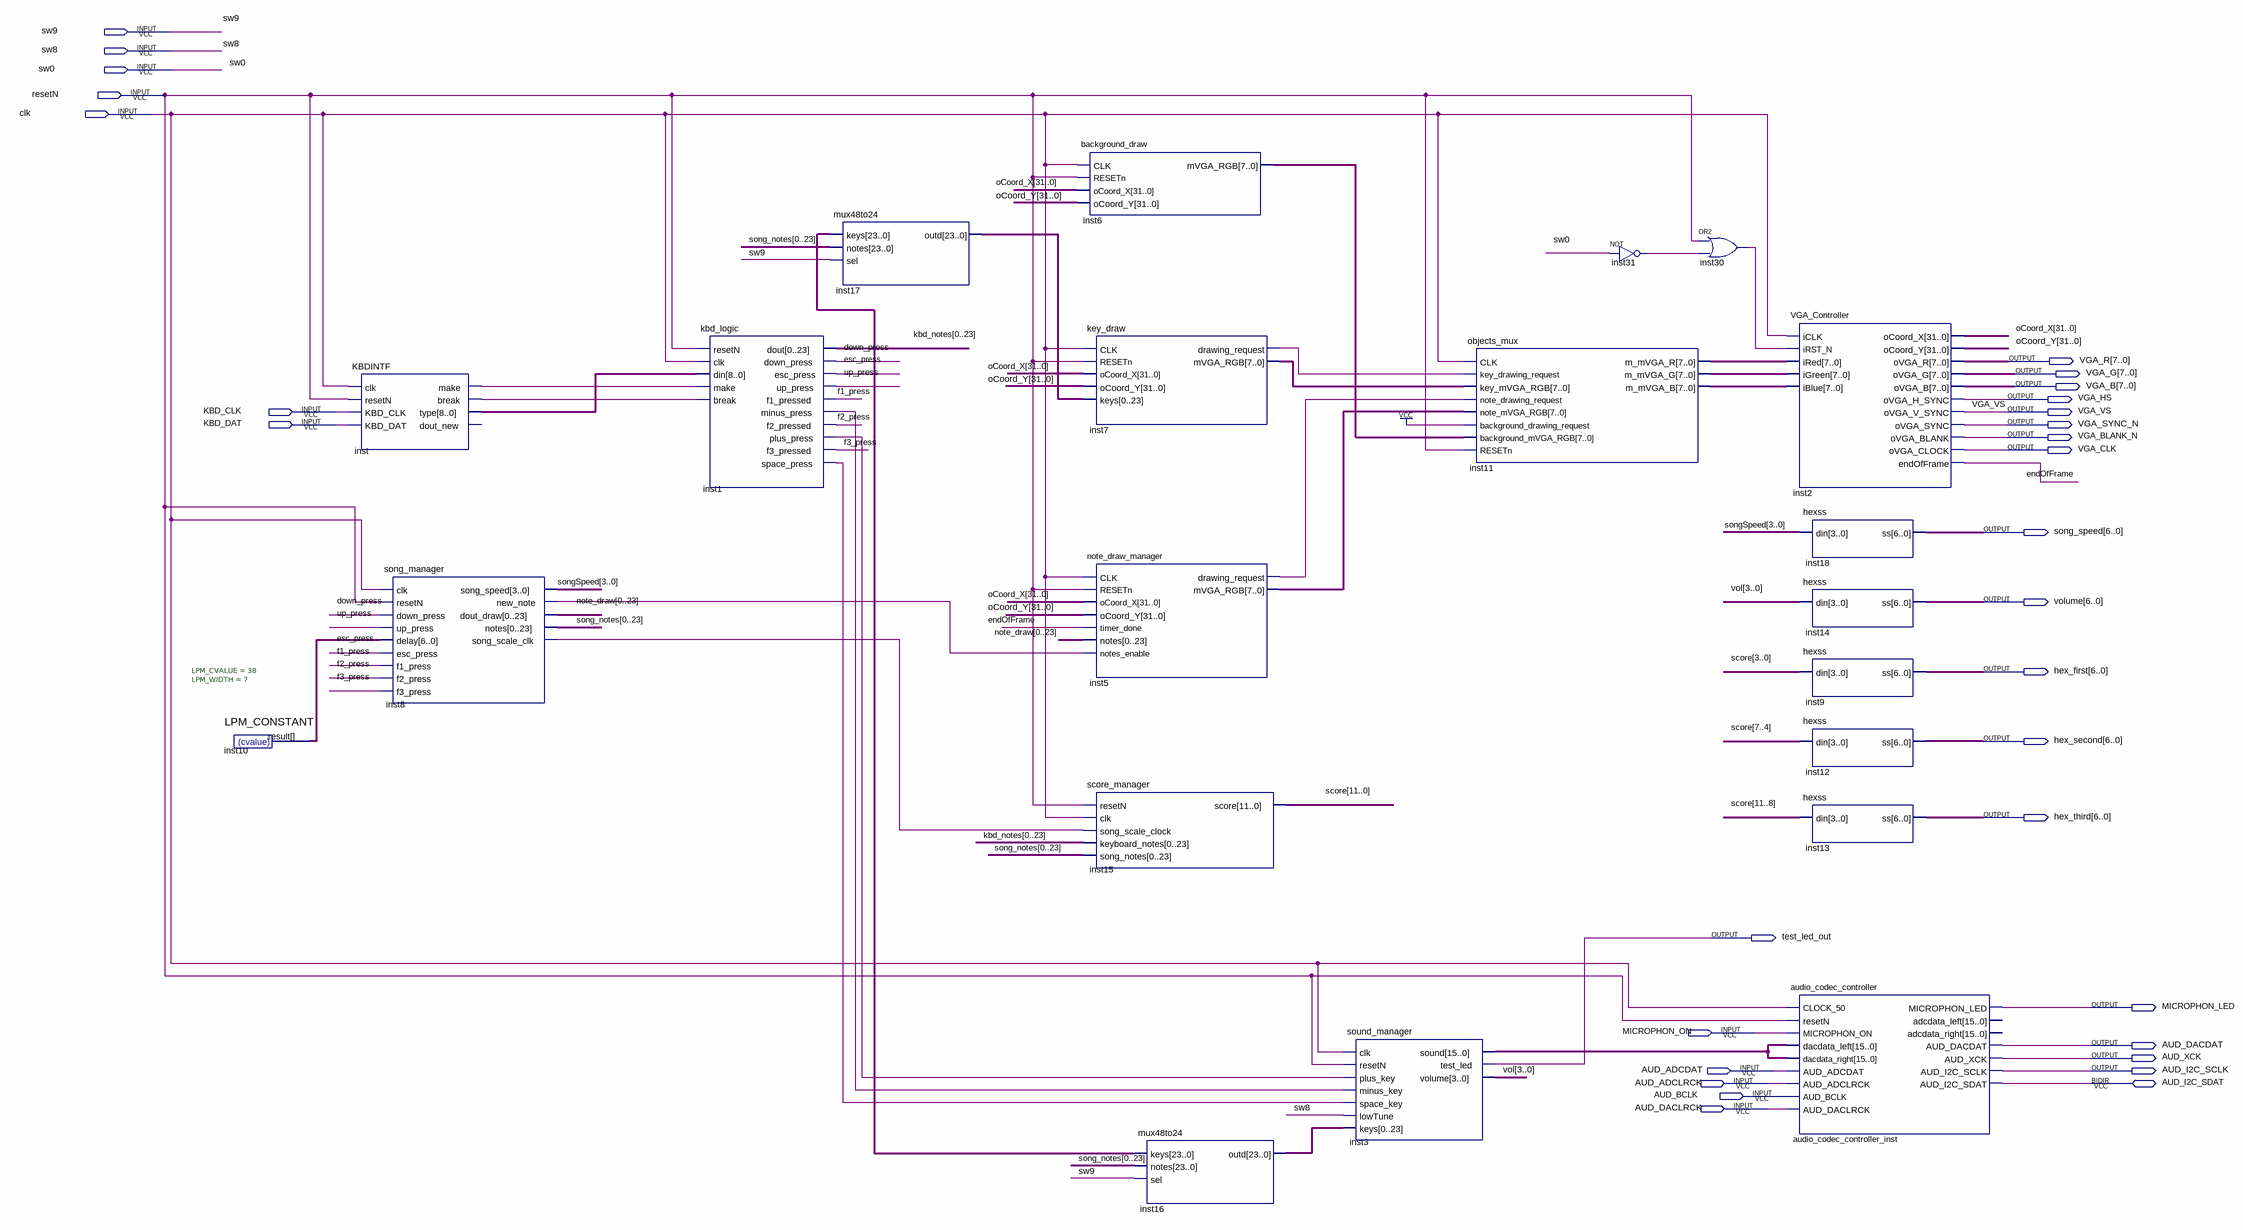
[diagram p0: schematic sheet]
// Quartus schematic top.bdf as structural Verilog: 21 symbols, 31 pins
module top (
  input  sw9,
  input  sw8,
  input  sw0,
  input  resetN,
  input  clk,
  input  KBD_CLK,
  input  KBD_DAT,
  input  MICROPHON_ON,
  input  AUD_ADCDAT,
  input  AUD_ADCLRCK,
  input  AUD_BCLK,
  input  AUD_DACLRCK,
  inout  AUD_I2C_SDAT,
  output [7:0] VGA_R,
  output [7:0] VGA_G,
  output [7:0] VGA_B,
  output VGA_HS,
  output VGA_VS,
  output VGA_SYNC_N,
  output VGA_BLANK_N,
  output VGA_CLK,
  output [6:0] song_speed,
  output [6:0] volume,
  output [6:0] hex_first,
  output [6:0] hex_second,
  output [6:0] hex_third,
  output test_led_out,
  output MICROPHON_LED,
  output AUD_DACDAT,
  output AUD_XCK,
  output AUD_I2C_SCLK
);

  wire down_press, endOfFrame, esc_press, f1_press, f2_press, f3_press, inst1_minus_press, inst1_plus_press,
       inst1_space_press, inst5_drawing_request, inst7_drawing_request, inst8_new_note, inst8_song_scale_clk,
       inst30_out, inst31_out, inst_break, inst_make, up_press;
  wire [3:0] songSpeed, vol;
  wire [6:0] inst10_result;
  wire [7:0] inst5_mvga_rgb, inst6_mvga_rgb, inst7_mvga_rgb, inst11_m_mvga_b, inst11_m_mvga_g,
       inst11_m_mvga_r;
  wire [8:0] inst_type;
  wire [11:0] score;
  wire [15:0] inst3_sound;
  wire [23:0] inst16_outd, inst17_outd, kbd_notes, note_draw, song_notes;
  wire [31:0] oCoord_X, oCoord_Y;

  LPM_CONSTANT #(.LPM_CVALUE(38), .LPM_WIDTH(7)) inst10 (.result(inst10_result));
  KBDINTF inst (
    .clk(clk), .resetN(resetN), .KBD_CLK(KBD_CLK), .KBD_DAT(KBD_DAT), .make(inst_make), .\break (inst_break),
    .\type (inst_type));  // open: dout_new
  song_manager inst8 (
    .clk(clk), .resetN(resetN), .down_press(down_press), .up_press(up_press), .delay(inst10_result),
    .esc_press(esc_press), .f1_press(f1_press), .f2_press(f2_press), .f3_press(f3_press),
    .song_speed(songSpeed), .new_note(inst8_new_note),
    .dout_draw({note_draw[0], note_draw[1], note_draw[2], note_draw[3], note_draw[4], note_draw[5], note_draw[6], note_draw[7], note_draw[8], note_draw[9], note_draw[10], note_draw[11], note_draw[12], note_draw[13], note_draw[14], note_draw[15], note_draw[16], note_draw[17], note_draw[18], note_draw[19], note_draw[20], note_draw[21], note_draw[22], note_draw[23]}),
    .notes({song_notes[0], song_notes[1], song_notes[2], song_notes[3], song_notes[4], song_notes[5], song_notes[6], song_notes[7], song_notes[8], song_notes[9], song_notes[10], song_notes[11], song_notes[12], song_notes[13], song_notes[14], song_notes[15], song_notes[16], song_notes[17], song_notes[18], song_notes[19], song_notes[20], song_notes[21], song_notes[22], song_notes[23]}),
    .song_scale_clk(inst8_song_scale_clk));
  kbd_logic inst1 (
    .resetN(resetN), .clk(clk), .din(inst_type), .make(inst_make), .\break (inst_break),
    .dout({kbd_notes[0], kbd_notes[1], kbd_notes[2], kbd_notes[3], kbd_notes[4], kbd_notes[5], kbd_notes[6], kbd_notes[7], kbd_notes[8], kbd_notes[9], kbd_notes[10], kbd_notes[11], kbd_notes[12], kbd_notes[13], kbd_notes[14], kbd_notes[15], kbd_notes[16], kbd_notes[17], kbd_notes[18], kbd_notes[19], kbd_notes[20], kbd_notes[21], kbd_notes[22], kbd_notes[23]}),
    .down_press(down_press), .esc_press(esc_press), .up_press(up_press), .f1_pressed(f1_press),
    .minus_press(inst1_minus_press), .f2_pressed(f2_press), .plus_press(inst1_plus_press),
    .f3_pressed(f3_press), .space_press(inst1_space_press));
  mux48to24 inst17 (
    .keys({kbd_notes[0], kbd_notes[1], kbd_notes[2], kbd_notes[3], kbd_notes[4], kbd_notes[5], kbd_notes[6], kbd_notes[7], kbd_notes[8], kbd_notes[9], kbd_notes[10], kbd_notes[11], kbd_notes[12], kbd_notes[13], kbd_notes[14], kbd_notes[15], kbd_notes[16], kbd_notes[17], kbd_notes[18], kbd_notes[19], kbd_notes[20], kbd_notes[21], kbd_notes[22], kbd_notes[23]}),
    .notes({song_notes[0], song_notes[1], song_notes[2], song_notes[3], song_notes[4], song_notes[5], song_notes[6], song_notes[7], song_notes[8], song_notes[9], song_notes[10], song_notes[11], song_notes[12], song_notes[13], song_notes[14], song_notes[15], song_notes[16], song_notes[17], song_notes[18], song_notes[19], song_notes[20], song_notes[21], song_notes[22], song_notes[23]}),
    .sel(sw9), .outd(inst17_outd));
  background_draw inst6 (
    .CLK(clk), .RESETn(resetN), .oCoord_X(oCoord_X), .oCoord_Y(oCoord_Y), .mVGA_RGB(inst6_mvga_rgb));
  key_draw inst7 (
    .CLK(clk), .RESETn(resetN), .oCoord_X(oCoord_X), .oCoord_Y(oCoord_Y), .keys(inst17_outd),
    .drawing_request(inst7_drawing_request), .mVGA_RGB(inst7_mvga_rgb));
  note_draw_manager inst5 (
    .CLK(clk), .RESETn(resetN), .oCoord_X(oCoord_X), .oCoord_Y(oCoord_Y), .timer_done(endOfFrame),
    .notes({note_draw[0], note_draw[1], note_draw[2], note_draw[3], note_draw[4], note_draw[5], note_draw[6], note_draw[7], note_draw[8], note_draw[9], note_draw[10], note_draw[11], note_draw[12], note_draw[13], note_draw[14], note_draw[15], note_draw[16], note_draw[17], note_draw[18], note_draw[19], note_draw[20], note_draw[21], note_draw[22], note_draw[23]}),
    .notes_enable(inst8_new_note), .drawing_request(inst5_drawing_request), .mVGA_RGB(inst5_mvga_rgb));
  score_manager inst15 (
    .resetN(resetN), .clk(clk), .song_scale_clock(inst8_song_scale_clk),
    .keyboard_notes({kbd_notes[0], kbd_notes[1], kbd_notes[2], kbd_notes[3], kbd_notes[4], kbd_notes[5], kbd_notes[6], kbd_notes[7], kbd_notes[8], kbd_notes[9], kbd_notes[10], kbd_notes[11], kbd_notes[12], kbd_notes[13], kbd_notes[14], kbd_notes[15], kbd_notes[16], kbd_notes[17], kbd_notes[18], kbd_notes[19], kbd_notes[20], kbd_notes[21], kbd_notes[22], kbd_notes[23]}),
    .song_notes({song_notes[0], song_notes[1], song_notes[2], song_notes[3], song_notes[4], song_notes[5], song_notes[6], song_notes[7], song_notes[8], song_notes[9], song_notes[10], song_notes[11], song_notes[12], song_notes[13], song_notes[14], song_notes[15], song_notes[16], song_notes[17], song_notes[18], song_notes[19], song_notes[20], song_notes[21], song_notes[22], song_notes[23]}),
    .score(score));
  mux48to24 inst16 (
    .keys({kbd_notes[0], kbd_notes[1], kbd_notes[2], kbd_notes[3], kbd_notes[4], kbd_notes[5], kbd_notes[6], kbd_notes[7], kbd_notes[8], kbd_notes[9], kbd_notes[10], kbd_notes[11], kbd_notes[12], kbd_notes[13], kbd_notes[14], kbd_notes[15], kbd_notes[16], kbd_notes[17], kbd_notes[18], kbd_notes[19], kbd_notes[20], kbd_notes[21], kbd_notes[22], kbd_notes[23]}),
    .notes({song_notes[0], song_notes[1], song_notes[2], song_notes[3], song_notes[4], song_notes[5], song_notes[6], song_notes[7], song_notes[8], song_notes[9], song_notes[10], song_notes[11], song_notes[12], song_notes[13], song_notes[14], song_notes[15], song_notes[16], song_notes[17], song_notes[18], song_notes[19], song_notes[20], song_notes[21], song_notes[22], song_notes[23]}),
    .sel(sw9), .outd(inst16_outd));
  sound_manager inst3 (
    .clk(clk), .resetN(resetN), .plus_key(inst1_plus_press), .minus_key(inst1_minus_press),
    .space_key(inst1_space_press), .lowTune(sw8), .keys(inst16_outd), .sound(inst3_sound),
    .test_led(test_led_out), .volume(vol));
  objects_mux inst11 (
    .CLK(clk), .key_drawing_request(inst7_drawing_request), .key_mVGA_RGB(inst7_mvga_rgb),
    .note_drawing_request(inst5_drawing_request), .note_mVGA_RGB(inst5_mvga_rgb),
    .background_drawing_request(1'b1), .background_mVGA_RGB(inst6_mvga_rgb), .RESETn(resetN),
    .m_mVGA_R(inst11_m_mvga_r), .m_mVGA_G(inst11_m_mvga_g), .m_mVGA_B(inst11_m_mvga_b));
  not inst31 (inst31_out, sw0);
  or inst30 (inst30_out, resetN, inst31_out);
  VGA_Controller inst2 (
    .iCLK(clk), .iRST_N(inst30_out), .iRed(inst11_m_mvga_r), .iGreen(inst11_m_mvga_g),
    .iBlue(inst11_m_mvga_b), .oCoord_X(oCoord_X), .oCoord_Y(oCoord_Y), .oVGA_R(VGA_R), .oVGA_G(VGA_G),
    .oVGA_B(VGA_B), .oVGA_H_SYNC(VGA_HS), .oVGA_V_SYNC(VGA_VS), .oVGA_SYNC(VGA_SYNC_N),
    .oVGA_BLANK(VGA_BLANK_N), .oVGA_CLOCK(VGA_CLK), .endOfFrame(endOfFrame));
  hexss inst18 (.din(songSpeed), .ss(song_speed));
  hexss inst14 (.din(vol), .ss(volume));
  hexss inst9 (.din(score[3:0]), .ss(hex_first));
  hexss inst12 (.din(score[7:4]), .ss(hex_second));
  hexss inst13 (.din(score[11:8]), .ss(hex_third));
  audio_codec_controller audio_codec_controller_inst (
    .CLOCK_50(clk), .resetN(resetN), .MICROPHON_ON(MICROPHON_ON), .dacdata_left(inst3_sound),
    .dacdata_right(inst3_sound), .AUD_ADCDAT(AUD_ADCDAT), .AUD_ADCLRCK(AUD_ADCLRCK), .AUD_BCLK(AUD_BCLK),
    .AUD_DACLRCK(AUD_DACLRCK), .MICROPHON_LED(MICROPHON_LED), .AUD_DACDAT(AUD_DACDAT), .AUD_XCK(AUD_XCK),
    .AUD_I2C_SCLK(AUD_I2C_SCLK), .AUD_I2C_SDAT(AUD_I2C_SDAT));  // open: adcdata_left, adcdata_right
endmodule
